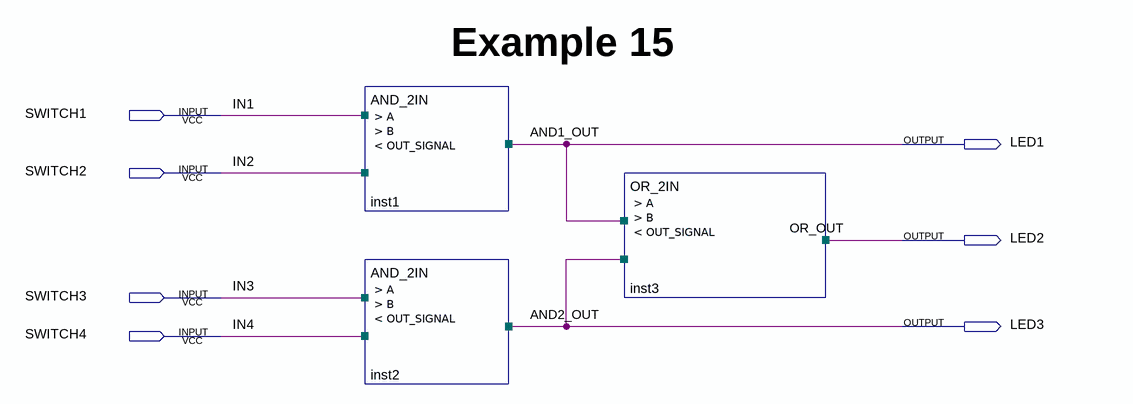
[diagram p0: schematic sheet]
// Quartus schematic ex15.bdf as structural Verilog: 3 symbols, 7 pins
module ex15 (
  input  SWITCH1,
  input  SWITCH2,
  input  SWITCH3,
  input  SWITCH4,
  output LED1,
  output LED2,
  output LED3
);

  AND_2IN inst1 (.A(SWITCH1), .B(SWITCH2), .OUT_SIGNAL(LED1));
  AND_2IN inst2 (.A(SWITCH3), .B(SWITCH4), .OUT_SIGNAL(LED3));
  OR_2IN inst3 (.A(LED1), .B(LED3), .OUT_SIGNAL(LED2));

  // Other names for the same wires on the sheet: AND1_OUT = LED1; AND2_OUT = LED3; IN1 = SWITCH1; IN2 = SWITCH2;
  //   IN3 = SWITCH3; IN4 = SWITCH4; OR_OUT = LED2

  // Notes on the sheet:
  //   Example 15
endmodule
